# EAGLE schematic fluorometer (EAGLE 9.6.2)
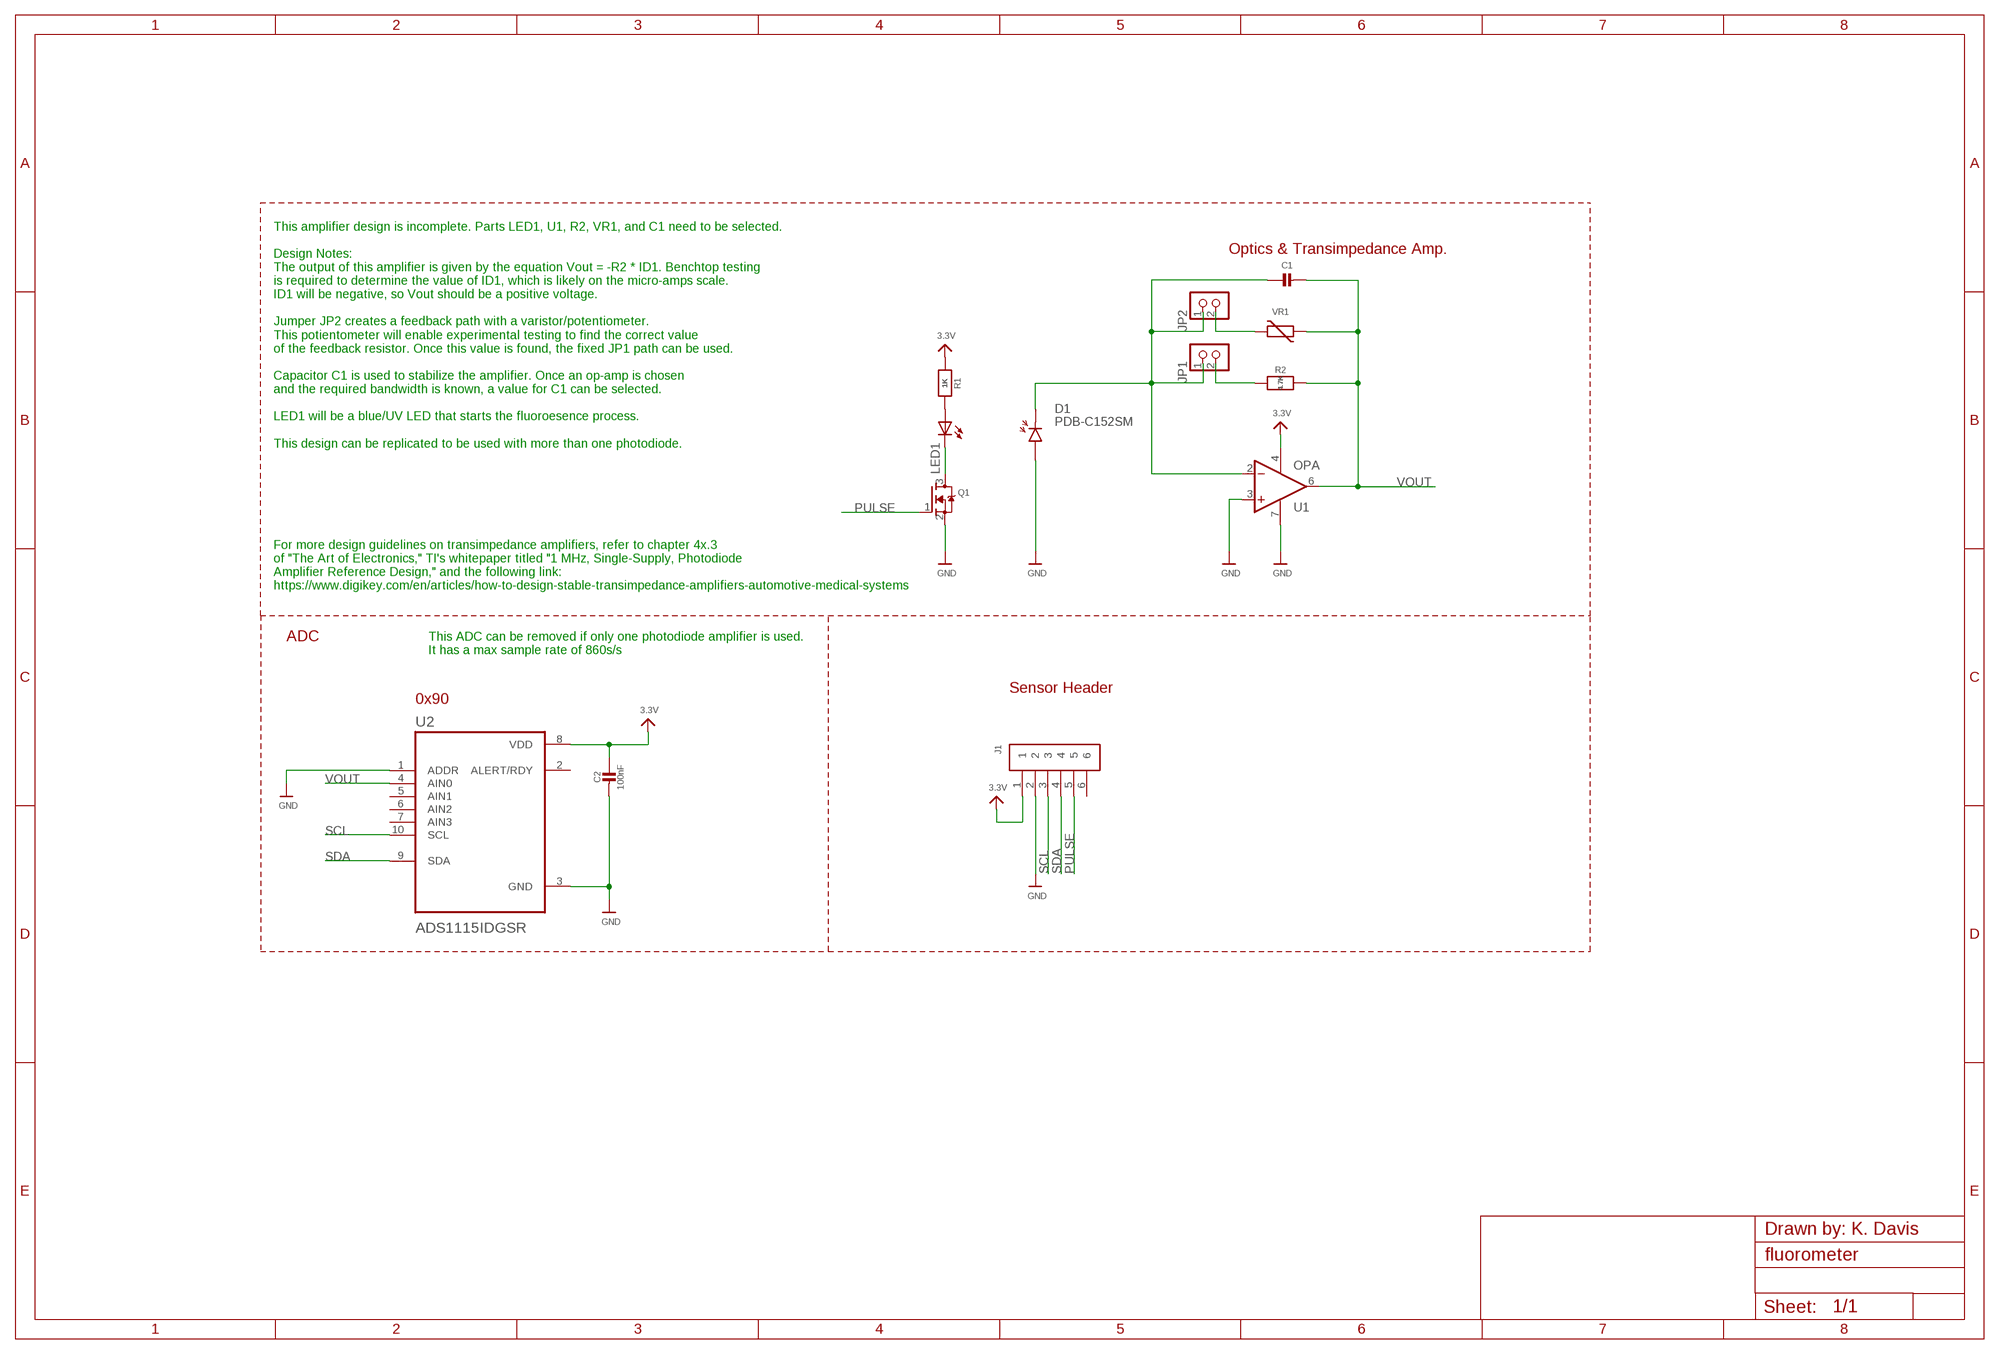
[diagram p0: schematic, sheet 1]

## Parts
C1  100nF  CAP_CERAMIC0805-NOOUTLINE  [0805-NO]
C2  100nF  CAP_CERAMIC0805-NOOUTLINE  [0805-NO]
D1  PDB-C152SM  [D1206]
J1  61300611121  [61300611121]
JP1  2PIN_HEADER  [1X2]
JP2  2PIN_HEADER  [1X2]
LED1  C2297  LEDCHIPLED_0805  [CHIPLED_0805]
Q1  BSS138  MOSFET-NWIDE  [SOT23-WIDE]
R1  1K  RESISTOR_0603_NOOUT  [0603-NO]
R2  4.7K  RESISTOR0805_NOOUTLINE  [0805-NO]
U1  OPA  THS4211  [S-PDSO-G08]
U2  ADS1115IDGSR  [SOP50P490X110-10N]
VR1  VARISTORCN1206  [CT/CN1206]

## Nets
3.3V: C2.1 J1.1 R1.1 U1.4(V-) U2.8(VDD)
GND: C2.2 D1.P$2(C) J1.2 Q1.2(S) U1.3(+IN) U1.7(V+) U2.1(ADDR) U2.3(GND)
N$1: C1.1 D1.P$1(A) JP1.1 JP2.1 U1.2(-IN)
N$2: JP1.2 R2.2
N$3: JP2.2 VR1.2
N$5: LED1.A R1.2
PULSE: J1.5 Q1.1(G)
SCL: J1.3 U2.10(SCL)
SDA: J1.4 U2.9(SDA)
STATUS_LEDS: LED1.C Q1.3(D)
VOUT: C1.2 R2.1 U1.6(OUT) U2.4(AIN0) VR1.1
Unconnected: J1.6 U1.TH U2.2(ALERT/RDY) U2.5(AIN1) U2.6(AIN2) U2.7(AIN3)

## Notes on the sheet
- Optics & Transimpedance Amp.
- This amplifier design is incomplete. Parts LED1, U1, R2, VR1, and C1 need to be selected.
  
  Design Notes:
  The output of this amplifier is given by the equation Vout = -R2 * ID1. Benchtop testing 
  is required to determine the value of ID1, which is likely on the micro-amps scale.
  ID1 will be negative, so Vout should be a positive voltage.
  
  Jumper JP2 creates a feedback path with a varistor/potentiometer. 
  This potientometer will enable experimental testing to find the correct value
  of the feedback resistor. Once this value is found, the fixed JP1 path can be used.
  
  Capacitor C1 is used to stabilize the amplifier. Once an op-amp is chosen 
  and the required bandwidth is known, a value for C1 can be selected.
  
  LED1 will be a blue/UV LED that starts the fluoroesence process.
  
  This design can be replicated to be used with more than one photodiode.
- For more design guidelines on transimpedance amplifiers, refer to chapter 4x.3
  of "The Art of Electronics," TI's whitepaper titled "1 MHz, Single-Supply, Photodiode
  Amplifier Reference Design," and the following link: 
  https://www.digikey.com/en/articles/how-to-design-stable-transimpedance-amplifiers-automotive-medical-systems
- ADC
- This ADC can be removed if only one photodiode amplifier is used.
  It has a max sample rate of 860s/s
- 0x90 | Sensor Header
- Drawn by: K. Davis

## Library data of the parts
C1 C2 = microbuilder:CAP_CERAMIC: Ceramic Capacitors For new designs, use the packages preceded by an '_' character since they are more reliable: The following footprints should be used on most boards: _0402 - Standard footprint for regular board layouts _0603 - Standard footprint for regular board layouts _0805 - Standard footprint for regular board layouts _1206 - Standard footprint for regular board layouts For extremely tight-pitch boards where space is at a premium, the following 'micro-pitch' footprints can be used (smaller pads, no silkscreen outline, etc.): _0402MP - Micro-pitch footprint for very dense/compact boards _0603MP - Micro-pitch footprint for very dense/compact boards _0805MP - Micro-pitch footprint for very dense/compact boards _1206MP - Micro-pitch footprint for very dense/compact boards
D1 = EarthPodLib:PDB-C152SM
J1 = EarthPodLib:61300611121: CONN HEADER VERT 5POS 2.54MM Manufacturer's datasheet <https://katalog.we-online.de/em/datasheet/6130xx11121.pdf>; CREATED_BY: PCBLayout.com; DIGI_KEY_PART_NUMBER: 732-5318-ND; MANUFACTURER: Wurth Electronics Inc.; MPN: 61300511121
JP1 JP2 = AgriPLCLib:2PIN_HEADER: Female Gray Connector strip for Arduino 3V3 bases - 10x1 F V h 8,5 p2,54mm
LED1 = adafruit:LED: LED OSRAM: - CHIPLED LG R971, LG N971, LY N971, LG Q971, LY Q971, LO R971, LY R971 LH N974, LH R974 LS Q976, LO Q976, LY Q976 LO Q996 - Hyper CHIPLED LW Q18S LB Q993, LB Q99A, LB R99A - SideLED LS A670, LO A670, LY A670, LG A670, LP A670 LB A673, LV A673, LT A673, LW A673 LH A674 LY A675 LS A676, LA A676, LO A676, LY A676, LW A676 LS A679, LY A679, LG A679 - Hyper Micro SIDELED® LS Y876, LA Y876, LO Y876, LY Y876 LT Y87S - SmartLED LW L88C, LW L88S LB L89C, LB L89S, LG L890 LS L89K, LO L89K, LY L89K LS L896, LA L896, LO L896, LY L896 - TOPLED LS T670, LO T670, LY T670, LG T670, LP T670 LSG T670, LSP T670, LSY T670, LOP T670, LYG T670 LG T671, LOG T671, LSG T671 LB T673, LV T673, LT T673, LW T673 LH T674 LS T676, LA T676, LO T676, LY T676, LB T676, LH T676, LSB T676, LW T676 LB T67C, LV T67C, LT T67C, LS T67K, LO T67K, LY T67K, LW E67C LS E67B, LA E67B, LO E67B, LY E67B, LB E67C, LV E67C, LT E67C LW T67C LS T679, LY T679, LG T679 LS T770, LO T770, LY T770, LG T770, LP T770 LB T773, LV T773, LT T773, LW T773 LH T774 LS E675, LA E675, LY E675, LS T675 LS T776, LA T776, LO T776, LY T776, LB T776 LHGB T686 LT T68C, LB T68C - Hyper Mini TOPLED® LB M676 - Mini TOPLED Santana® LG M470 LS M47K, LO M47K, LY M47K Source: http://www.osram.convergy.de/
Q1 = microbuilder:MOSFET-N: N-Channel Mosfet LEGEND VDS: Voltage Drain-Source ID: Drain Current RDS(ON): Drain-Source On-State Resistance VGS(TH): Gate-Source Threshold Voltage CISS: Drain-Source Input Capacitance SOT-23 Name VDS ID RDS(ON) VGS(TH) CISS Order Number 2N7002E 60V 260mA 2.5 Ohm 2.5V @ 250uA 26.7pF @ 25V 2N7002ET1GOSTR-ND BSH103 30V 850mA 400 mOhm 400mV @ 1mA 83pF @ 24V BSH103,235-ND BSS138 60V 320mA 1.6 Ohm 1.5V @ 250uA 50pF @ 10V Mouser: 771-BSS138PW115 DMN2075U-7 20V 4.2A 38 mOhm 1V @ 250 uA 594.3pF @ 10V DMN2075U-7DICT-ND * BSS138 good choice for I2C level-shifting POWERPAK 1212-8 Name VDS ID RDS(ON) VGS(TH) CISS Order Number Si7308DN 60V 6A 58 mOhm 3V @ 250uA 665pF @ 15V SI7308DN-T1-E3CT-ND
R1 R2 = microbuilder:RESISTOR: Resistors For new designs, use the packages preceded by an '_' character since they are more reliable: The following footprints should be used on most boards: _0402 - Standard footprint for regular board layouts _0603 - Standard footprint for regular board layouts _0805 - Standard footprint for regular board layouts _1206 - Standard footprint for regular board layouts For extremely tight-pitch boards where space is at a premium, the following 'micro-pitch' footprints can be used (smaller pads, no silkscreen outline, etc.): _0402MP - Micro-pitch footprint for very dense/compact boards _0603MP - Micro-pitch footprint for very dense/compact boards _0805MP - Micro-pitch footprint for very dense/compact boards _1206MP - Micro-pitch footprint for very dense/compact boards
U1 = texas:THS4211: LOW-DISTORTION, HIGH-SPEED, VOLTAGE FEEDBACK AMPLIFIER Source: http://focus.ti.com/lit/ds/symlink/ths4211.pdf; MF: TEXAS INSTRUMENT CONNECTORS; MPN: THS4211DGK; OC_FARNELL: 8453306; OC_NEWARK: 95H4489
U2 = EarthPodLib:ADS1115IDGSR: Check availability <https://pricing.snapeda.com/parts/ADS1115IDGSR/Texas%20Instruments/view-part?ref=eda>; AVAILABILITY: In Stock; DESCRIPTION: 16-Bit 860SPS 4-Ch Delta-Sigma ADC With PGA, Oscillator, Vref, Comparator, and I2C 10-VSSOP -40 to 125; MF: Texas Instruments; MP: ADS1115IDGSR; PACKAGE: VSSOP-10 Texas Instruments; PRICE: None; PURCHASE-URL: https://pricing.snapeda.com/search/part/ADS1115IDGSR/?ref=eda
VR1 = varistor:VARISTOR: VARISTOR

## Net classes
1 highpower: width 0.305 mm, drill 0.483 mm
2 lowpower: width 0.254 mm, drill 0.483 mm